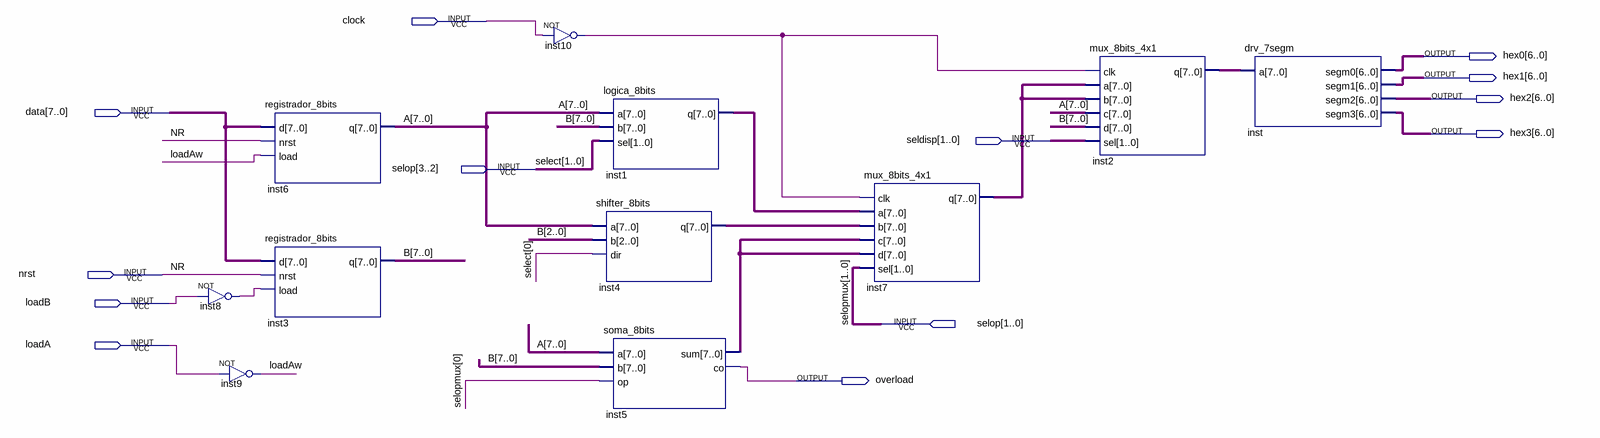
[diagram p0: schematic sheet]
// Quartus schematic myULA_top.bdf as structural Verilog: 11 symbols, 13 pins
module myULA_top (
  input  clock,
  input  [7:0] data,
  input  [1:0] seldisp,
  input  [3:0] selop,
  input  nrst,
  input  loadB,
  input  loadA,
  output [6:0] hex0,
  output [6:0] hex1,
  output [6:0] hex2,
  output [6:0] hex3,
  output overload
);

  wire inst8_out, inst10_out, loadAw;
  wire [7:0] A, B, inst1_q, inst2_q, inst4_q, inst5_sum, inst7_q;

  not inst8 (inst8_out, loadB);
  not inst9 (loadAw, loadA);
  registrador_8bits inst6 (.d(data), .nrst(nrst), .load(loadAw), .q(A));
  registrador_8bits inst3 (.d(data), .nrst(nrst), .load(inst8_out), .q(B));
  not inst10 (inst10_out, clock);
  logica_8bits inst1 (.a(A), .b(B), .sel(selop[3:2]), .q(inst1_q));
  shifter_8bits inst4 (.a(A), .b(B[2:0]), .dir(selop[2]), .q(inst4_q));
  soma_8bits inst5 (.a(A), .b(B), .op(selop[0]), .sum(inst5_sum), .co(overload));
  mux_8bits_4x1 inst7 (
    .clk(inst10_out), .a(inst1_q), .b(inst4_q), .c(inst5_sum), .d(inst5_sum), .sel(selop[1:0]), .q(inst7_q));
  mux_8bits_4x1 inst2 (.clk(inst10_out), .a(inst7_q), .b(inst7_q), .c(A), .d(B), .sel(seldisp), .q(inst2_q));
  drv_7segm inst (.a(inst2_q), .segm0(hex0), .segm1(hex1), .segm2(hex2), .segm3(hex3));

  // Other names for the same wires on the sheet: NR = nrst; select[1:0] = selop[3:2]; selopmux[1:0] = selop[1:0]
endmodule
